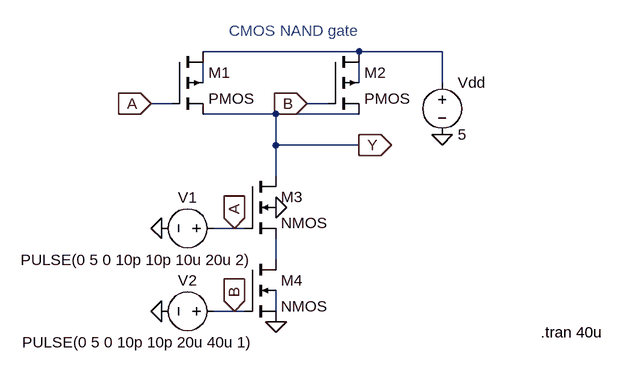
[diagram p0: schematic CMOS_NAND.asc]
CMOS_NAND.asc, the LTspice schematic file:
Version 4
SHEET 1 960 680
WIRE 576 48 336 48
WIRE 704 48 576 48
WIRE 336 96 336 64
WIRE 576 96 576 64
WIRE 704 96 704 48
WIRE 288 128 256 128
WIRE 528 128 496 128
WIRE 448 144 336 144
WIRE 576 144 448 144
WIRE 448 192 448 144
WIRE 576 192 448 192
WIRE 448 240 448 192
WIRE 384 320 352 320
WIRE 400 320 384 320
WIRE 448 368 448 336
WIRE 384 448 352 448
WIRE 400 448 384 448
WIRE 448 448 448 416
FLAG 448 288 0
FLAG 256 128 A
IOPIN 256 128 In
FLAG 496 128 B
IOPIN 496 128 In
FLAG 384 320 A
IOPIN 384 320 In
FLAG 384 448 B
IOPIN 384 448 In
FLAG 576 192 Y
IOPIN 576 192 Out
FLAG 272 320 0
FLAG 272 448 0
FLAG 704 176 0
FLAG 448 464 0
SYMBOL pmos4 288 48 R0
SYMATTR InstName M1
SYMBOL pmos4 528 48 R0
SYMATTR InstName M2
SYMBOL nmos4 400 240 R0
SYMATTR InstName M3
SYMBOL nmos4 400 368 R0
SYMATTR InstName M4
SYMBOL voltage 368 320 R90
WINDOW 0 -32 56 VBottom 2
WINDOW 3 33 134 VTop 2
SYMATTR InstName V1
SYMATTR Value PULSE(0 5 0 10p 10p 10u 20u 2)
SYMBOL voltage 368 448 R90
WINDOW 0 -32 56 VBottom 2
WINDOW 3 32 132 VTop 2
SYMATTR InstName V2
SYMATTR Value PULSE(0 5 0 10p 10p 20u 40u 1)
SYMBOL voltage 704 80 R0
SYMATTR InstName Vdd
SYMATTR Value 5
TEXT 376 16 Left 2 ;CMOS NAND gate
TEXT 856 480 Left 2 !.tran 40u

The netlist it stands for:
* CMOS_NAND.asc
M1 N001 A Y N002 PMOS
M2 N001 B Y N003 PMOS
M3 Y A N004 0 NMOS
M4 N004 B 0 N005 NMOS
V1 A 0 PULSE(0 5 0 10p 10p 10u 20u 2)
V2 B 0 PULSE(0 5 0 10p 10p 20u 40u 1)
Vdd N001 0 5
.model NMOS NMOS
.model PMOS PMOS
.lib standard.mos
* CMOS NAND gate
.tran 40u
.backanno
.end